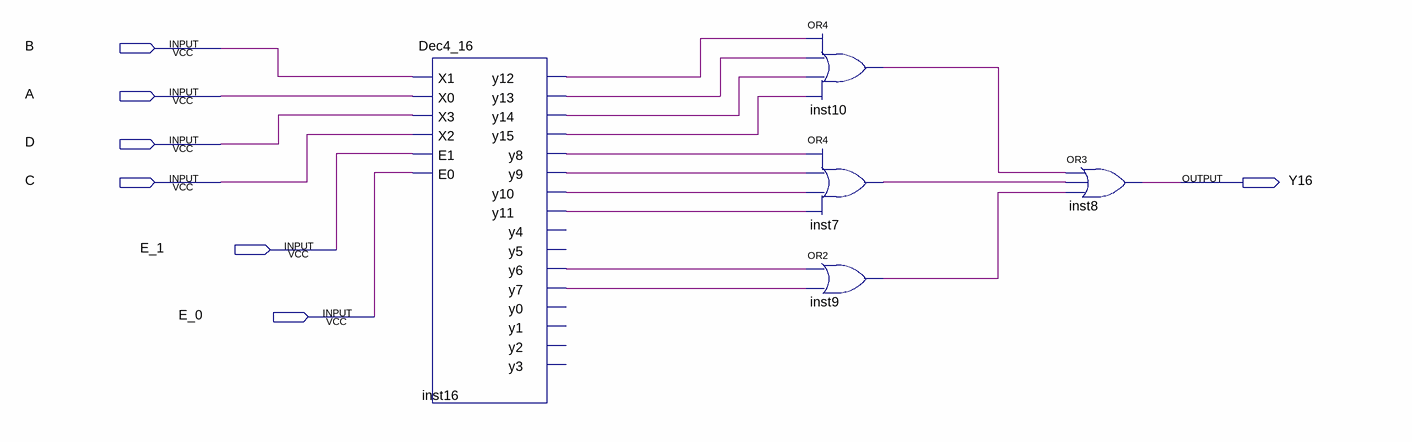
[diagram p0: schematic sheet]
// Quartus schematic DecoderDemo3.bdf as structural Verilog: 5 symbols, 7 pins
module DecoderDemo3 (
  input  B,
  input  A,
  input  D,
  input  C,
  input  E_1,
  input  E_0,
  output Y16
);

  wire inst7_out, inst9_out, inst10_out, inst16_y6, inst16_y7, inst16_y8, inst16_y9, inst16_y10, inst16_y11,
       inst16_y12, inst16_y13, inst16_y14, inst16_y15;

  Dec4_16 inst16 (
    .X1(B), .X0(A), .X3(D), .X2(C), .E1(E_1), .E0(E_0), .y12(inst16_y12), .y13(inst16_y13), .y14(inst16_y14),
    .y15(inst16_y15), .y8(inst16_y8), .y9(inst16_y9), .y10(inst16_y10), .y11(inst16_y11), .y6(inst16_y6),
    .y7(inst16_y7));  // open: y4, y5, y0, y1, y2, y3
  or inst10 (inst10_out, inst16_y12, inst16_y13, inst16_y14, inst16_y15);
  or inst7 (inst7_out, inst16_y8, inst16_y9, inst16_y10, inst16_y11);
  or inst9 (inst9_out, inst16_y6, inst16_y7);
  or inst8 (Y16, inst10_out, inst7_out, inst9_out);
endmodule
